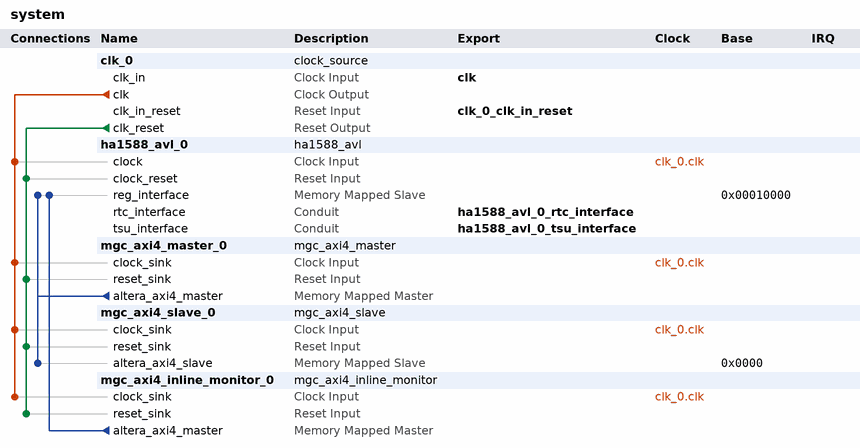
[diagram p0: system contents]
# Platform Designer (Qsys) system system, Cyclone V 5CSEBA5U19A7
# Parameters at their usual value, and those the tool derives, are not listed.
package require -exact qsys 12.1
create_system system
set_project_property DEVICE_FAMILY {Cyclone V}
set_project_property DEVICE 5CSEBA5U19A7

add_instance clk_0 clock_source 12.1
set_instance_parameter_value clk_0 clockFrequency 50000000

add_instance ha1588_avl_0 ha1588_avl 1.0
set_instance_parameter_value ha1588_avl_0 addr_is_in_word true

add_instance mgc_axi4_master_0 mgc_axi4_master 10.1.3.1
set_instance_parameter_value mgc_axi4_master_0 AXI4_ADDRESS_WIDTH 32
set_instance_parameter_value mgc_axi4_master_0 AXI4_RDATA_WIDTH 32
set_instance_parameter_value mgc_axi4_master_0 AXI4_WDATA_WIDTH 32
set_instance_parameter_value mgc_axi4_master_0 AXI4_ID_WIDTH 8
set_instance_parameter_value mgc_axi4_master_0 AXI4_USER_WIDTH 8
set_instance_parameter_value mgc_axi4_master_0 AXI4_REGION_MAP_SIZE 16
set_instance_parameter_value mgc_axi4_master_0 index 0

add_instance mgc_axi4_slave_0 mgc_axi4_slave 10.1.3.1
set_instance_parameter_value mgc_axi4_slave_0 AXI4_ADDRESS_WIDTH 16
set_instance_parameter_value mgc_axi4_slave_0 AXI4_RDATA_WIDTH 1024
set_instance_parameter_value mgc_axi4_slave_0 AXI4_WDATA_WIDTH 1024
set_instance_parameter_value mgc_axi4_slave_0 AXI4_ID_WIDTH 18
set_instance_parameter_value mgc_axi4_slave_0 AXI4_USER_WIDTH 8
set_instance_parameter_value mgc_axi4_slave_0 AXI4_REGION_MAP_SIZE 16
set_instance_parameter_value mgc_axi4_slave_0 index 0

add_instance mgc_axi4_inline_monitor_0 mgc_axi4_inline_monitor 10.1.3.1
set_instance_parameter_value mgc_axi4_inline_monitor_0 AXI4_ADDRESS_WIDTH 32
set_instance_parameter_value mgc_axi4_inline_monitor_0 AXI4_RDATA_WIDTH 32
set_instance_parameter_value mgc_axi4_inline_monitor_0 AXI4_WDATA_WIDTH 32
set_instance_parameter_value mgc_axi4_inline_monitor_0 AXI4_ID_WIDTH 8
set_instance_parameter_value mgc_axi4_inline_monitor_0 AXI4_USER_WIDTH 8
set_instance_parameter_value mgc_axi4_inline_monitor_0 AXI4_REGION_MAP_SIZE 16
set_instance_parameter_value mgc_axi4_inline_monitor_0 index 0

# connections
add_connection clk_0.clk ha1588_avl_0.clock clock
add_connection clk_0.clk mgc_axi4_inline_monitor_0.clock_sink clock
add_connection clk_0.clk mgc_axi4_master_0.clock_sink clock
add_connection clk_0.clk mgc_axi4_slave_0.clock_sink clock
add_connection clk_0.clk_reset ha1588_avl_0.clock_reset reset
add_connection clk_0.clk_reset mgc_axi4_inline_monitor_0.reset_sink reset
add_connection clk_0.clk_reset mgc_axi4_master_0.reset_sink reset
add_connection clk_0.clk_reset mgc_axi4_slave_0.reset_sink reset
add_connection mgc_axi4_inline_monitor_0.altera_axi4_master ha1588_avl_0.reg_interface avalon
set_connection_parameter_value mgc_axi4_inline_monitor_0.altera_axi4_master/ha1588_avl_0.reg_interface baseAddress 0x00010000
add_connection mgc_axi4_master_0.altera_axi4_master ha1588_avl_0.reg_interface avalon
set_connection_parameter_value mgc_axi4_master_0.altera_axi4_master/ha1588_avl_0.reg_interface baseAddress 0x00010000
add_connection mgc_axi4_master_0.altera_axi4_master mgc_axi4_slave_0.altera_axi4_slave avalon
set_connection_parameter_value mgc_axi4_master_0.altera_axi4_master/mgc_axi4_slave_0.altera_axi4_slave baseAddress 0x0000

# exported interfaces
add_interface clk clock sink
set_interface_property clk EXPORT_OF clk_0.clk_in
add_interface ha1588_avl_0_rtc_interface conduit end
set_interface_property ha1588_avl_0_rtc_interface EXPORT_OF ha1588_avl_0.rtc_interface
add_interface ha1588_avl_0_tsu_interface conduit end
set_interface_property ha1588_avl_0_tsu_interface EXPORT_OF ha1588_avl_0.tsu_interface
add_interface clk_0_clk_in_reset reset sink
set_interface_property clk_0_clk_in_reset EXPORT_OF clk_0.clk_in_reset

save_system system.qsys
